# Altium schematic sheet Hydrophones_RA_Adapter_1.SchDoc
size A
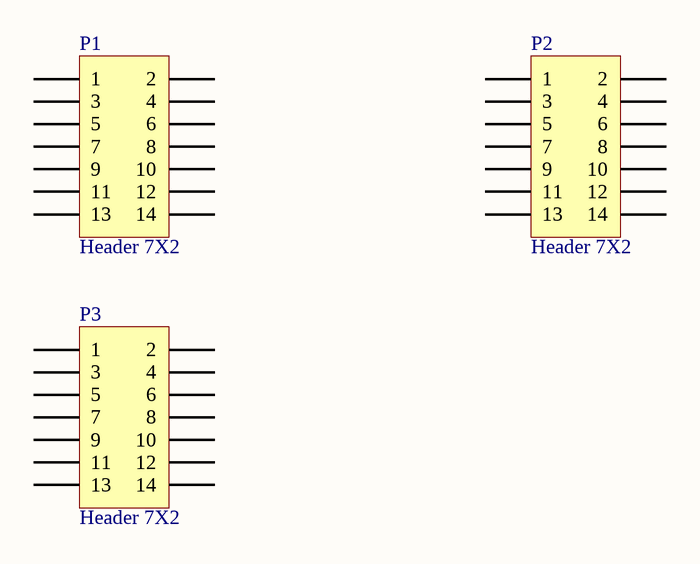
[diagram p0: Hydrophones_RA_Adapter_1.SchDoc]

## Parts
P1  Header 7X2  [CLP-107-02-L-DH]
P2  Header 7X2  [FTSH-107-01-F-DV]
P3  Header 7X2  [CLP-107-02-L-DH]

## Nets

Not connected (* = marked no-connect by the designer): P1 1 2 3 4 5 6 7 8 9 10 11 12 13 14; P2 1 2 3 4 5 6 7 8 9 10 11 12 13 14; P3 1 2 3 4 5 6 7 8 9 10 11 12 13 14

## Library data of the parts
P1-P3 = Header 7X2: Header, 7-Pin, Dual row; LatestRevisionDate: 17-Jul-2002; LatestRevisionNote: Re-released for DXP Platform.; Publisher: Altium Limited